# Altium schematic sheet Power.SchDoc
size A4; SheetNumber: 3; SheetTotal: 5; SPICEModelCacheTHDQVSGM: <root> / <DocumentId>THDQVSGM</DocumentId> / <CacheFrame Number="0"> / <Model Name="led0" Kind="MDL"> / <Text>*Typ INFRARED GaAs LED: Vf=1.2V Vr=5V If=40mA trr=3uS / *LED Pinout: 1=A, 2=K / .MODEL LED0 D (IS=93.5P RS=84M N=2.63 BV=5 IBV=10U / + CJO=2.97P VJ=.75 M=.333 TT=4.32U)</Text> / </Model> / </CacheFrame> / </root>
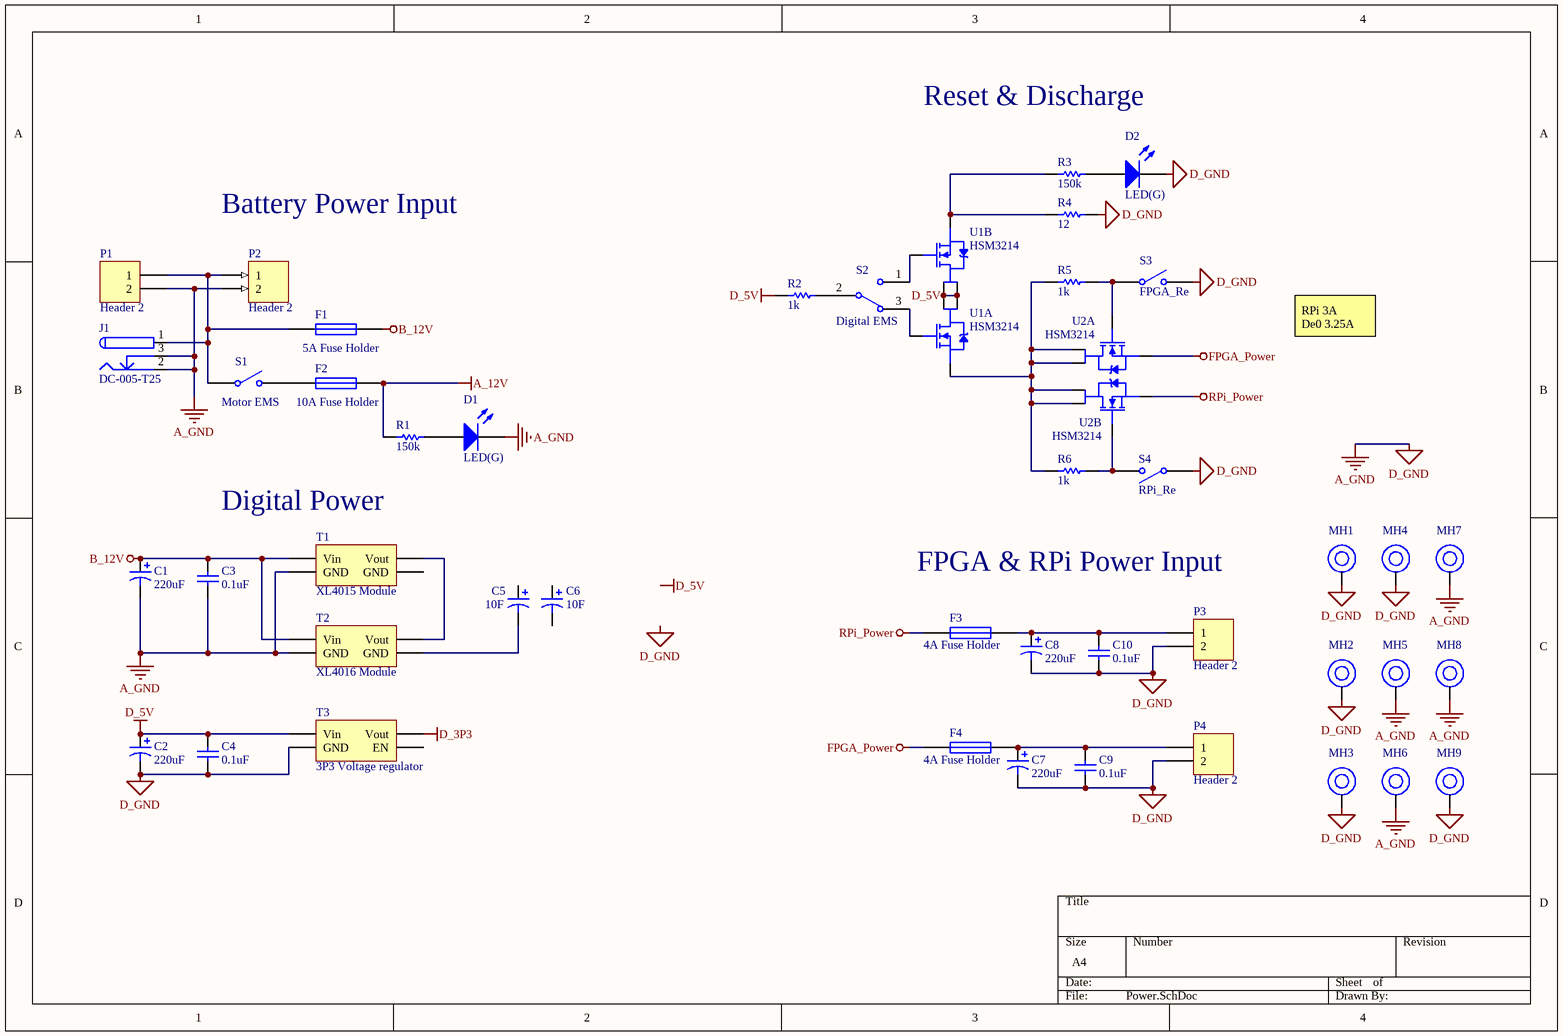
[diagram p0: Power.SchDoc]

## Parts
C1  220uF  [VZT221M1ETR-0607]
C2  220uF  [VZT221M1ETR-0607]
C3  0.1uF  [1210B104K500NT]
C4  0.1uF  [1210B104K500NT]
C5  10F  [SUPPYCAP-DIP_L33.0_W16.5]
C6  10F  [SUPPYCAP-DIP_L33.0_W16.5]
C7  220uF  [VZT221M1ETR-0607]
C8  220uF  [VZT221M1ETR-0607]
C9  0.1uF  [1210B104K500NT]
C10  0.1uF  [1210B104K500NT]
D1  LED(G)  [BL-HG036D-AV-TRB]
D2  LED(G)  [BL-HG036D-AV-TRB]
F1  5A Fuse Holder  [SMD Fuses Holder]
F2  10A Fuse Holder  [SMD Fuses Holder]
F3  4A Fuse Holder  [SMD Fuses Holder]
F4  4A Fuse Holder  [SMD Fuses Holder]
J1  DC-005-T25  [DC-005-T25]
MH1  M3 Hole  [M3 Hole]  (value not drawn)
MH2  M3 Hole  [M3 Hole]  (value not drawn)
MH3  M3 Hole  [M3 Hole]  (value not drawn)
MH4  M3 Hole  [M3 Hole]  (value not drawn)
MH5  M3 Hole  [M3 Hole]  (value not drawn)
MH6  M3 Hole  [M3 Hole]  (value not drawn)
MH7  M3 Hole  [M3 Hole]  (value not drawn)
MH8  M3 Hole  [M3 Hole]  (value not drawn)
MH9  M3 Hole  [M3 Hole]  (value not drawn)
P1  Header 2  [XT60PW-M]
P2  Header 2  [B2B-XH-A(LF)(SN)]
P3  Header 2  [B2B-XH-A(LF)(SN)]
P4  Header 2  [B2B-XH-A(LF)(SN)]
R1  150k  [RS-03K1503FT]
R2  1k  [RS-03K1503FT]
R3  150k  [RS-03K1503FT]
R4  12  [MOF3WS-12Ω±5%T]
R5  1k  [RS-03K1503FT]
R6  1k  [RS-03K1503FT]
S1  Motor EMS  [JNQ032]
S2  Digital EMS  [ST-0-102-C03-N003-RS]
S3  FPGA_Re  [SKHMQLE010]
S4  RPi_Re  [SKHMQKE010]
T1  XL4015 Module  [XL4015 Voltage Regulator Module]
T2  XL4016 Module  [XH-M401 Voltage Regulator Module]
T3  3P3 Voltage regulator  [Small Voltage regulator module]
U1  HSM3214  [HSM3214]  (parts A,B of 2)
U2  HSM3214  [HSM3214]  (parts A,B of 2)

## Nets
A_12V: F2.2 R1.2
A_GND: C1.2 C2.2 C3.1 C4.1 C7.2 C8.2 C9.1 C10.1 D1.2(K) D2.2(K) J1.2 J1.3 MH1.1 MH2.1 MH3.1 MH4.1 MH5.1 MH6.1 MH7.1 MH8.1 MH9.1 P1.2 P2.2 P3.2 P4.2 R4.1 S3.2(NO) S4.1(COMMON) T1.2(GND) T2.2(GND) T3.2(GND)  [also labelled D_GND]
B_12V: C1.1 C3.2 F1.2 T1.1(Vin) T2.1(Vin)
D_3P3: T3.3(Vout)
D_5V: C2.1 C4.2 R2.2 T3.1(Vin) U1.5(D1) U1.6(D1) U1.7(D1) U1.8(D1)
FPGA_Power: F4.1 U2.1(S1)
RPi_Power: F3.1 U2.3(S1)
NetC5_2: C5.2 T2.4(GND)
NetC7_1: C7.1 C9.2 F4.2 P4.1
NetC8_1: C8.1 C10.2 F3.2 P3.1
NetD1_1: D1.1(A) R1.1
NetD2_1: D2.1(A) R3.1
NetF1_1: F1.1 J1.1 P1.1 P2.1 S1.1(COMMON)
NetF2_1: F2.1 S1.2(NO)
NetR2_1: R2.1 S2.2
NetR3_2: R3.2 R4.2 U1.3(S1)
NetR5_1: R5.1 S3.1(COMMON) U2.2(G1)
NetR5_2: R5.2 R6.2 U1.1(S1) U2.5(D1) U2.6(D1) U2.7(D1) U2.8(D1)
NetR6_1: R6.1 S4.2(NO) U2.4(G1)
NetS2_1: S2.1 U1.4(G1)
NetS2_3: S2.3 U1.2(G1)
NetT1_3: T1.3(Vout) T2.3(Vout)

Not connected (* = marked no-connect by the designer): C5 1; C6 1 2; T1 4(GND); T3 4(EN)

## Notes on the sheet
- Reset & Discharge
- Battery Power Input
- RPi 3A
  De0 3.25A
- Digital Power
- FPGA & RPi Power Input
- Labels drawn without touching a wire or pin: D_5V, D_GND

## Library data of the parts
C1 C2 C7 C8 = Cap Pol1: -45℃~+105℃ 2000hrs@105℃ 220uF 7.7mm 25V 6.3mm ±20% SMD,6.3x7.7mm  Aluminum Electrolytic Capacitors - SMD ROHS; Published: 8-Jun-2000; LatestRevisionDate: 17-Jul-2002; LatestRevisionNote: Re-released for DXP Platform.; PackageReference: RB7.6-15; Publisher: Altium Limited; PackageDescription: Polarized Capacitor (Radial); 2 Leads
C3 C4 C9 C10 = Cap Semi: 50V 100nF X7R ±10% 1210  Multilayer Ceramic Capacitors MLCC - SMD/SMT ROHS; Published: 8-Jun-2000; LatestRevisionDate: 29-May-2009; LatestRevisionNote: IPC-7351 Footprint Added.; PackageReference: C1206; Publisher: Altium Limited; PackageDescription: Chip Capacitor
C5 C6 = Cap Pol1: CAPACITOR 10F -10% +30% 5.5V T/H; Published: 8-Jun-2000; LatestRevisionDate: 17-Jul-2002; LatestRevisionNote: Re-released for DXP Platform.; PackageReference: RB7.6-15; Publisher: Altium Limited; PackageDescription: Polarized Capacitor (Radial); 2 Leads
D1 D2 = LED0: Green-yellow 0603 Light Emitting Diodes (LED) RoHS; Published: 8-Jun-2000; LatestRevisionDate: 08-Jul-2005; LatestRevisionNote: Mech Layer 1 removed.; PackageReference: LED-0; Publisher: Altium Limited; PackageDescription: LED; 2 Leads
F1 = Fuse 1: 01550900M (Fuse Holder) / SMD,9.73x5.03mm Fuse Holders ROHS / ----- / 0451005.MRL (Fuse) / FastBlow 50A SMD Fuse 5A 5.566 12.5mΩ SMD  Fuses ROHS; Published: 8-Jun-2000; LatestRevisionDate: 17-Jul-2002; LatestRevisionNote: Re-released for DXP Platform.; PackageReference: PIN-W2/E2.8; Publisher: Altium Limited; PackageDescription: Thru-Hole; 2 Leads
F2 = Fuse 1: 01550900M (Fuse Holder) / SMD,9.73x5.03mm Fuse Holders ROHS / ----- / 0451010.MRL (Fuse) / FastBlow 50A SMD Fuse 10A 26.46 5.6mΩ SMD  Fuses ROHS; Published: 8-Jun-2000; LatestRevisionDate: 17-Jul-2002; LatestRevisionNote: Re-released for DXP Platform.; PackageReference: PIN-W2/E2.8; Publisher: Altium Limited; PackageDescription: Thru-Hole; 2 Leads
F3 F4 = Fuse 1: 01550900M (Fuse Holder) / SMD,9.73x5.03mm Fuse Holders ROHS / ----- / 0451004.MRL (Fuse) / FastBlow 50A SMD Fuse 4A 3.152 16mΩ SMD  Fuses ROHS; Published: 8-Jun-2000; LatestRevisionDate: 17-Jul-2002; LatestRevisionNote: Re-released for DXP Platform.; PackageReference: PIN-W2/E2.8; Publisher: Altium Limited; PackageDescription: Thru-Hole; 2 Leads
J1 = PWR2.5: Shrouded DC Power Receptacle -10℃~+60℃ 2.5mm 6.3mm 3A 30V Plugin AC/DC Power Connectors ROHS; Published: 17-Dec-2003; DatasheetDocument: 09-May-2002; Publisher: Altium Limited; ComponentLink1Description: Manufacturer Link; ComponentLink1URL: http://domino.kycon.com/internet/Products.html
MH1-MH9 = M3_Hole
P1 = Header 2: XT60PW-F 500V 45A Through Hole Power Connectors ROHS; LatestRevisionDate: 17-Jul-2002; LatestRevisionNote: Re-released for DXP Platform.; Publisher: Altium Limited
P2-P4 = Header 2: 1x2P XH 1 2.5mm 2 Brass Plugin,P=2.5mm  Wire To Board / Wire To Wire Connector ROHS; LatestRevisionDate: 17-Jul-2002; LatestRevisionNote: Re-released for DXP Platform.; Publisher: Altium Limited
R1-R3 R5 R6 = Res1: 100mW 50V ±1% ±100ppm/℃ -55℃~+155℃ 150kΩ 0603  Chip Resistor - Surface Mount ROHS; Published: 8-Jun-2000; LatestRevisionDate: 17-Jul-2002; LatestRevisionNote: Re-released for DXP Platform.; PackageReference: AXIAL-0.3; Publisher: Altium Limited; PackageDescription: Axial Device, Thru-Hole; 2 Leads; 0.3 in Pin Spacing
R4 = Res1: Metal Oxide Resistors 12Ω 3W ±700ppm/℃ ±5% Axial Leaded  Through Hole Resistors ROHS; Published: 8-Jun-2000; LatestRevisionDate: 17-Jul-2002; LatestRevisionNote: Re-released for DXP Platform.; PackageReference: AXIAL-0.3; Publisher: Altium Limited; PackageDescription: Axial Device, Thru-Hole; 2 Leads; 0.3 in Pin Spacing
S1 = SW-SPST: JNQ032 (Header) / 30A Short Connection Quick connect terminal Plugin  Cold-pressed?Terminals ROHS / ----- / RT-S02-113-R42BR (Switch) / Through Hole Rocker Switches ROHS; Published: 24-Mar-1999; LatestRevisionDate: 17-Jul-2002; LatestRevisionNote: Re-released for DXP Platform.; PackageReference: SPST-2; Publisher: Altium Limited; PackageDescription: Switch; 2 Leads
S2 = SW-SPDT: Cylindrical button handle 125V -25℃~85℃ SPDT PCPin 40000 3A Plugin  Toggle Switches ROHS; Published: 24-Mar-1999; LatestRevisionDate: 17-Dec-2003; LatestRevisionNote: Schematic revised, PCB Footprint replaced.; DatasheetVersion: 05-Dec-2000; PackageReference: TL36WW15050; Publisher: Altium Limited; PackageDescription: Switch; 4 Leads; ComponentLink1Description: Manufacturer Link; ComponentLink1URL: http://www.apem.com
S3 S4 = SW-SPST: 6.2mm 3.1mm Round Button 50mA Brick nogging 6.5mm SPST 12V SMD  Tactile Switches ROHS; Published: 24-Mar-1999; LatestRevisionDate: 17-Jul-2002; LatestRevisionNote: Re-released for DXP Platform.; PackageReference: SPST-2; Publisher: Altium Limited; PackageDescription: Switch; 2 Leads
T1 = Non-isolated Voltage regulator: XL4015E1 (Module) / Step-down type TO-263-5  DC-DC Converters ROHS / ----- / A2541HWV-2x2P (Header) / 2.54mm 2.54mm Gold Brass Straight 2x2P 4 2 Plugin,P=2.54mm  Female Headers ROHS
T2 = Non-isolated Voltage regulator: NO Step-down type 1 Step-down 1.25V~36V 8V~40V 8A 180kHz TO-220-5  DC-DC Converters ROHS
T3 = Non-isolated Voltage regulator: 3A Non-isolated Voltage Regulator; ComponentLink1Description: buy_link; ComponentLink1URL: https://www.ruten.com.tw/item/show?21817939184609
U1 U2 = HSM3214: 30V 10A 12mΩ@10V,8A 1.5W 2.5V@250μA 2 N-Channel SOP-8  MOSFETs ROHS